# EAGLE design MySensors.org-BaseSensorWithPIR (EAGLE 7.5.0)
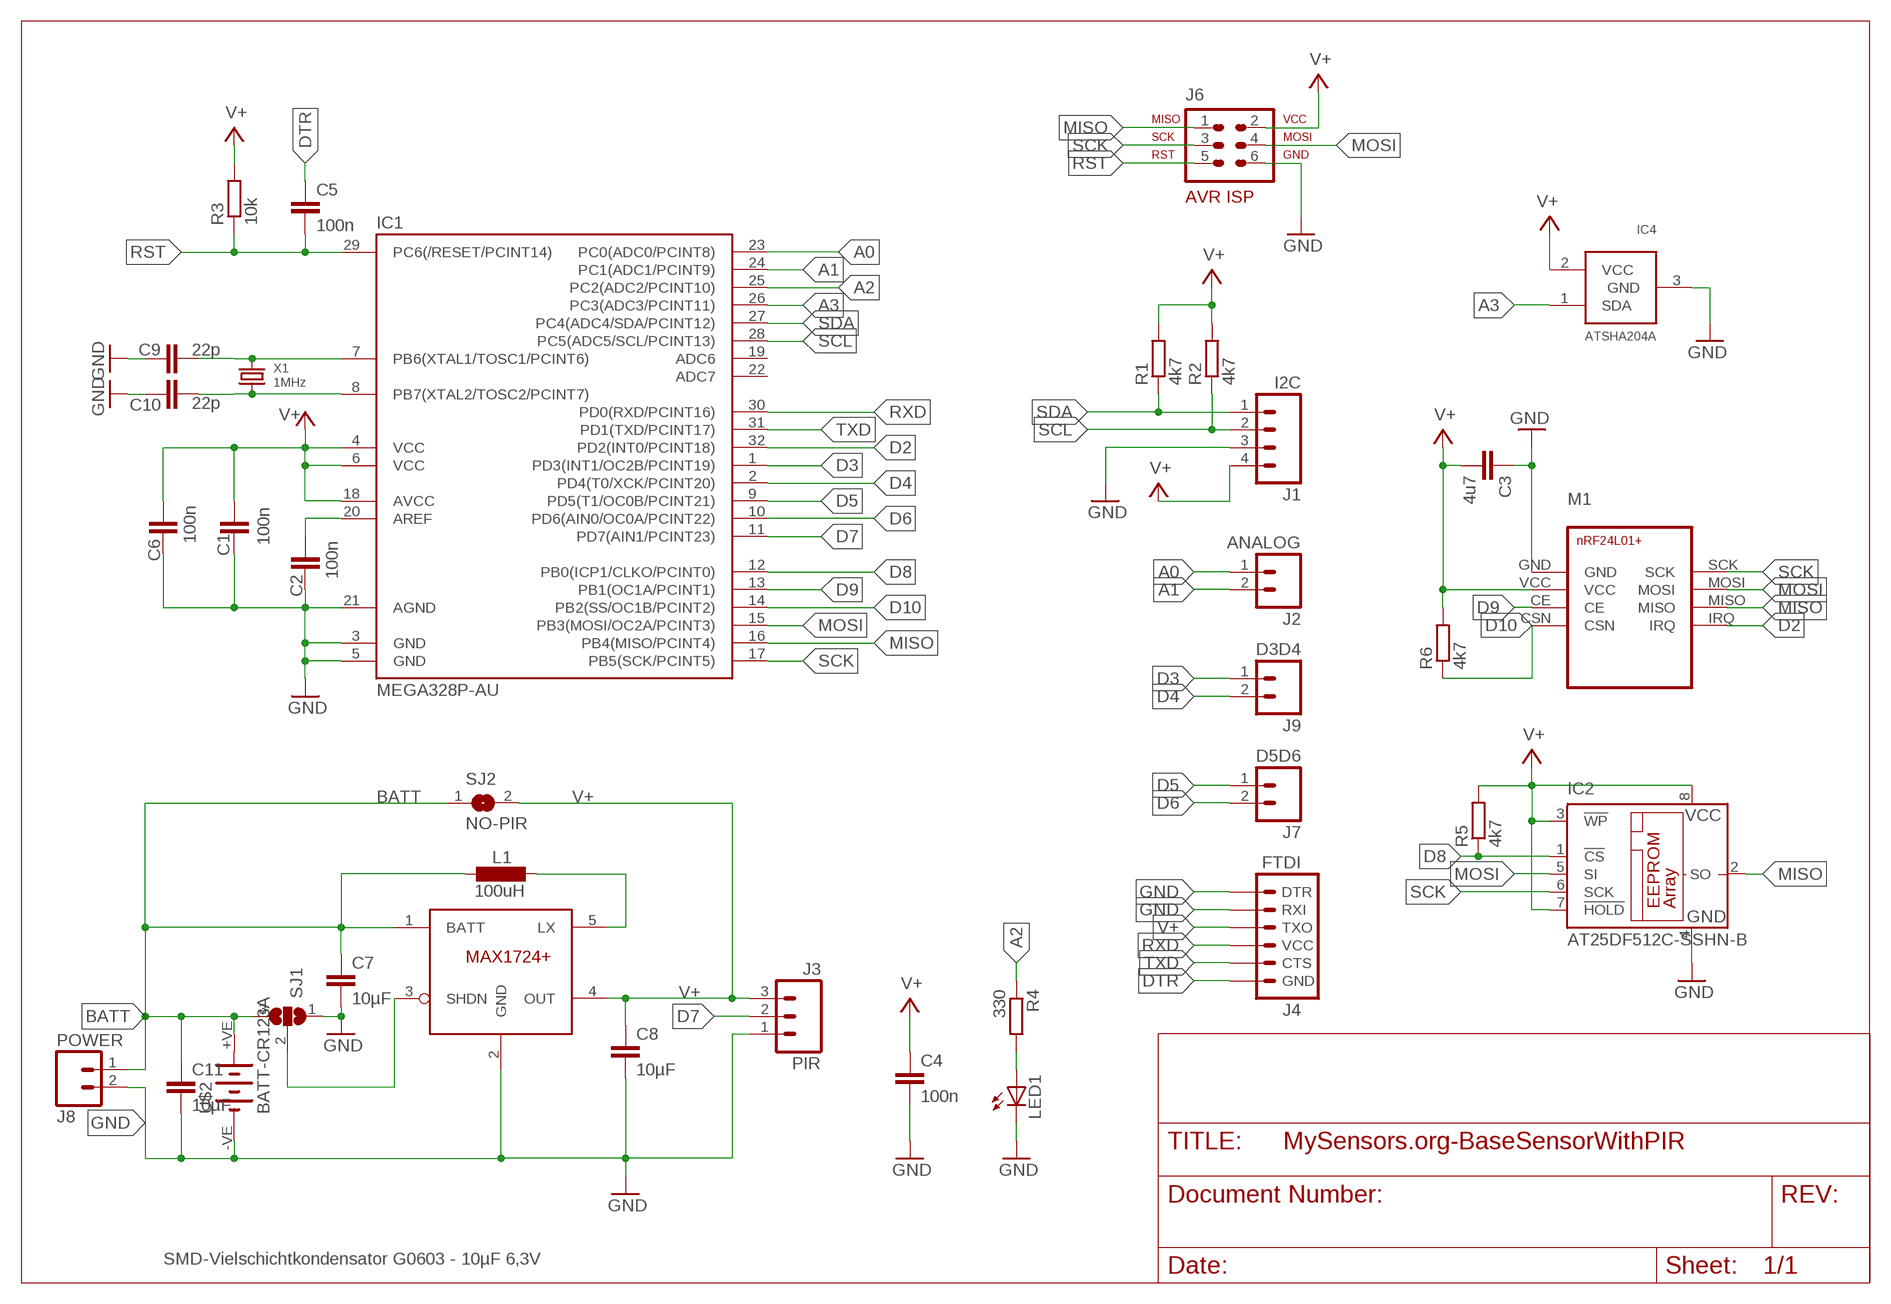
[diagram p0: schematic, sheet 1]

## Parts
C1  100n  C-EUC0603  [C0603]
C2  100n  C-EUC0603  [C0603]
C3  4u7  C-EUC0603  [C0603]
C4  100n  C-EUC0603  [C0603]
C5  100n  C-EUC0603  [C0603]
C6  100n  C-EUC0603  [C0603]
C7  10µF  C-EUC0603  [C0603]
C8  10µF  C-EUC0603  [C0603]
C9  22p  C-EUC0603  [C0603]
C10  22p  C-EUC0603  [C0603]
C11  10µF  C-EUC0603  [C0603]
IC1  MEGA328P-AU  MEGA48/88/168-AU  [TQFP32-08]
IC2  AT25DF512C-SSHN-B  25AA080SN  [SO-08]
IC4  ATSHA204A  [SOT23]
J1  I2C  M04LOCK  [1X04_LOCK]
J2  ANALOG  M02PTH  [1X02]
J3  PIR  M03LOCK  [1X03_LOCK]
J4  FTDI  ARDUINO_SERIAL_PROGRAMLOCK  [1X06_LOCK]
J6  N/M  AVR-ISP-6VERT  [AVR-ISP-6]
J7  D5D6  M02PTH  [1X02]
J8  POWER  M02PTH  [1X02]
J9  D3D4  M02PTH  [1X02]
L1  100uH  L-EU1212FPS  [1212FPS]
LED1  LEDSML0603  [SML0603]
M1  NRF24L01+NRF24L01+MINI  [NRF24L01+MINI]
R1  4k7  R-EU_R0603  [R0603]
R2  4k7  R-EU_R0603  [R0603]
R3  10k  R-EU_R0603  [R0603]
R4  330  R-EU_R0603  [R0603]
R5  4k7  R-EU_R0603  [R0603]
R6  4k7  R-EU_R0603  [R0603]
SJ1  SJ2W  [SJ_2]
SJ2  NO-PIR  SJ  [SJ]
STEPUP  MAX1724  [SOT23-5L]
U$2  BATT-CR123A  [KEYSTONE-2/3A]
X1  1MHz  CRYSTAL-306010055  [2P-L3.2XW1.5MM]

## Nets
A0: IC1.23(PC0(ADC0/PCINT8)) J2.1
A1: IC1.24(PC1(ADC1/PCINT9)) J2.2
A2: IC1.25(PC2(ADC2/PCINT10)) R4.1
A3: IC1.26(PC3(ADC3/PCINT11)) IC4.1(SDA)
BATT: C7.1 C11.1 J8.1 L1.1 SJ1.3 SJ2.1 STEPUP.1(BATT) U$2.+VE(+)
D2: IC1.32(PD2(INT0/PCINT18)) M1.IRQ
D3: IC1.1(PD3(INT1/OC2B/PCINT19)) J9.1
D4: IC1.2(PD4(T0/XCK/PCINT20)) J9.2
D5: IC1.9(PD5(T1/OC0B/PCINT21)) J7.1
D6: IC1.10(PD6(AIN0/OC0A/PCINT22)) J7.2
D7: IC1.11(PD7(AIN1/PCINT23)) J3.2
D8: IC1.12(PB0(ICP1/CLKO/PCINT0)) IC2.1(!CS) R5.1
D9: IC1.13(PB1(OC1A/PCINT1)) M1.CE
D10: IC1.14(PB2(SS/OC1B/PCINT2)) M1.CSN R6.1
DTR: C5.1 J4.6(GND)
GND [Power]: C1.2 C2.2 C3.1 C4.2 C6.2 C7.2 C8.2 C9.2 C10.2 C11.2 IC1.3(GND) IC1.5(GND) IC1.21(AGND) IC2.4(GND) IC4.3(GND) J1.3 J3.1 J4.1(DTR) J4.2(RXI) J6.6 J8.2 LED1.C M1.GND SJ1.1 STEPUP.2(GND) U$2.-VE(-)
LX: L1.2 STEPUP.5(LX)
MISO: IC1.16(PB4(MISO/PCINT4)) IC2.2(SO) J6.1 M1.MISO
MOSI: IC1.15(PB3(MOSI/OC2A/PCINT3)) IC2.5(SI) J6.4 M1.MOSI
N$3: LED1.A R4.2
N$4: C2.1 IC1.20(AREF)
RST: C5.2 IC1.29(PC6(/RESET/PCINT14)) J6.5 R3.1
RXD: IC1.30(PD0(RXD/PCINT16)) J4.4(VCC)
SCK: IC1.17(PB5(SCK/PCINT5)) IC2.6(SCK) J6.3 M1.SCK
SCL: IC1.28(PC5(ADC5/SCL/PCINT13)) J1.2 R2.1
SDA: IC1.27(PC4(ADC4/SDA/PCINT12)) J1.1 R1.1
SHDN: SJ1.2 STEPUP.3(SHDN)
TXD: IC1.31(PD1(TXD/PCINT17)) J4.5(CTS)
V+ [Power]: C1.1 C3.2 C4.1 C6.1 C8.1 IC1.4(VCC) IC1.6(VCC) IC1.18(AVCC) IC2.3(!WP) IC2.7(!HOLD) IC2.8(VCC) IC4.2(VCC) J1.4 J3.3 J4.3(TXO) J6.2 M1.VCC R1.2 R2.2 R3.2 R5.2 R6.2 SJ2.2 STEPUP.4(OUT)
XTAL1: C9.1 IC1.7(PB6(XTAL1/TOSC1/PCINT6)) X1.2
XTAL2: C10.1 IC1.8(PB7(XTAL2/TOSC2/PCINT7)) X1.1
Unconnected: IC1.19(ADC6) IC1.22(ADC7)

## Notes on the sheet
- SMD-Vielschichtkondensator G0603 - 10µF 6,3V

## Library data of the parts
C1-C11 = rcl:C-EU: CAPACITOR, European symbol
IC1 = avr-7:MEGA48/88/168
IC2 = microchip:25*: Serial EEPROM 4K/ 8K , SPI bus; MF: MICROCHIP; MPN: 25AA080/SN; OC_FARNELL: 1816072; OC_NEWARK: 92C7351
IC4 = Sensor:ATSHA204A
J1 = SparkFun-Connectors:M04: Header 4 Standard 4-pin 0.1" header. Use with straight break away headers (SKU : PRT-00116), right angle break away headers (PRT-00553), swiss pins (PRT-00743), machine pins (PRT-00117), and female headers (PRT-00115). Molex polarized connector foot print use with SKU : PRT-08231 with associated crimp pins and housings. 1MM SMD Version SKU: PRT-10208; PROD_ID: CONN-09696
J2 J7-J9 = SparkFun-Connectors:M02: Standard 2-pin 0.1" header. Use with - straight break away headers ( PRT-00116) - right angle break away headers (PRT-00553) - swiss pins (PRT-00743) - machine pins (PRT-00117) - female headers (PRT-00115) Molex polarized connector foot print use with: PRT-08233 with associated crimp pins and housings. 2.54_SCREWTERM for use with PRT-10571. 3.5mm Screw Terminal footprints for PRT-08084 5mm Screw Terminal footprints for use with PRT-08432
J3 = SparkFun-Connectors:M03: Header 3 Standard 3-pin 0.1" header. Use with straight break away headers (SKU : PRT-00116), right angle break away headers (PRT-00553), swiss pins (PRT-00743), machine pins (PRT-00117), and female headers (PRT-00115). Molex polarized connector foot print use with SKU : PRT-08232 with associated crimp pins and housings.
J4 = SparkFun-Connectors:ARDUINO_SERIAL_PROGRAM: FTDI connector footprints
J6 = avr-7:AVR-ISP-6: AVR ISP-6 Serial Programming Header
L1 = inductor:L-EU: INDUCTOR, European symbol
LED1 = led:LED: LED OSRAM: - CHIPLED LG R971, LG N971, LY N971, LG Q971, LY Q971, LO R971, LY R971 LH N974, LH R974 LS Q976, LO Q976, LY Q976 LO Q996 - Hyper CHIPLED LW Q18S LB Q993, LB Q99A, LB R99A - SideLED LS A670, LO A670, LY A670, LG A670, LP A670 LB A673, LV A673, LT A673, LW A673 LH A674 LY A675 LS A676, LA A676, LO A676, LY A676, LW A676 LS A679, LY A679, LG A679 - Hyper Micro SIDELED® LS Y876, LA Y876, LO Y876, LY Y876 LT Y87S - SmartLED LW L88C, LW L88S LB L89C, LB L89S, LG L890 LS L89K, LO L89K, LY L89K LS L896, LA L896, LO L896, LY L896 - TOPLED LS T670, LO T670, LY T670, LG T670, LP T670 LSG T670, LSP T670, LSY T670, LOP T670, LYG T670 LG T671, LOG T671, LSG T671 LB T673, LV T673, LT T673, LW T673 LH T674 LS T676, LA T676, LO T676, LY T676, LB T676, LH T676, LSB T676, LW T676 LB T67C, LV T67C, LT T67C, LS T67K, LO T67K, LY T67K, LW E67C LS E67B, LA E67B, LO E67B, LY E67B, LB E67C, LV E67C, LT E67C LW T67C LS T679, LY T679, LG T679 LS T770, LO T770, LY T770, LG T770, LP T770 LB T773, LV T773, LT T773, LW T773 LH T774 LS E675, LA E675, LY E675, LS T675 LS T776, LA T776, LO T776, LY T776, LB T776 LHGB T686 LT T68C, LB T68C - Hyper Mini TOPLED® LB M676 - Mini TOPLED Santana® LG M470 LS M47K, LO M47K, LY M47K Source: http://www.osram.convergy.de LUXEON: - LUMILED® LXK2-PW12-R00, LXK2-PW12-S00, LXK2-PW14-U00, LXK2-PW14-V00 LXK2-PM12-R00, LXK2-PM12-S00, LXK2-PM14-U00 LXK2-PE12-Q00, LXK2-PE12-R00, LXK2-PE12-S00, LXK2-PE14-T00, LXK2-PE14-U00 LXK2-PB12-K00, LXK2-PB12-L00, LXK2-PB12-M00, LXK2-PB14-N00, LXK2-PB14-P00, LXK2-PB14-Q00 LXK2-PR12-L00, LXK2-PR12-M00, LXK2-PR14-Q00, LXK2-PR14-R00 LXK2-PD12-Q00, LXK2-PD12-R00, LXK2-PD12-S00 LXK2-PH12-R00, LXK2-PH12-S00 LXK2-PL12-P00, LXK2-PL12-Q00, LXK2-PL12-R00 Source: www.luxeon.com KINGBRIGHT: KA-3528ASYC Source: www.kingbright.com
M1 = my_modules:NRF24L01+: nRF24L01+ Transceiver Module
R1-R6 = rcl:R-EU_: RESISTOR, European symbol
SJ1 = jumper:SJ2W: SMD solder JUMPER
SJ2 = jumper:SJ: SMD solder JUMPER
STEPUP = MAX1724:MAX1724
U$2 = Gulpman:BATT-CR123A: CR123A (2/3rd AA) battery holder Manufacturer: Keystone Mouser part: 534-1019
X1 = cristal:CRYSTAL*

## Net classes
0 default: width 0.203 mm
1 Power: width 0.406 mm

## Board
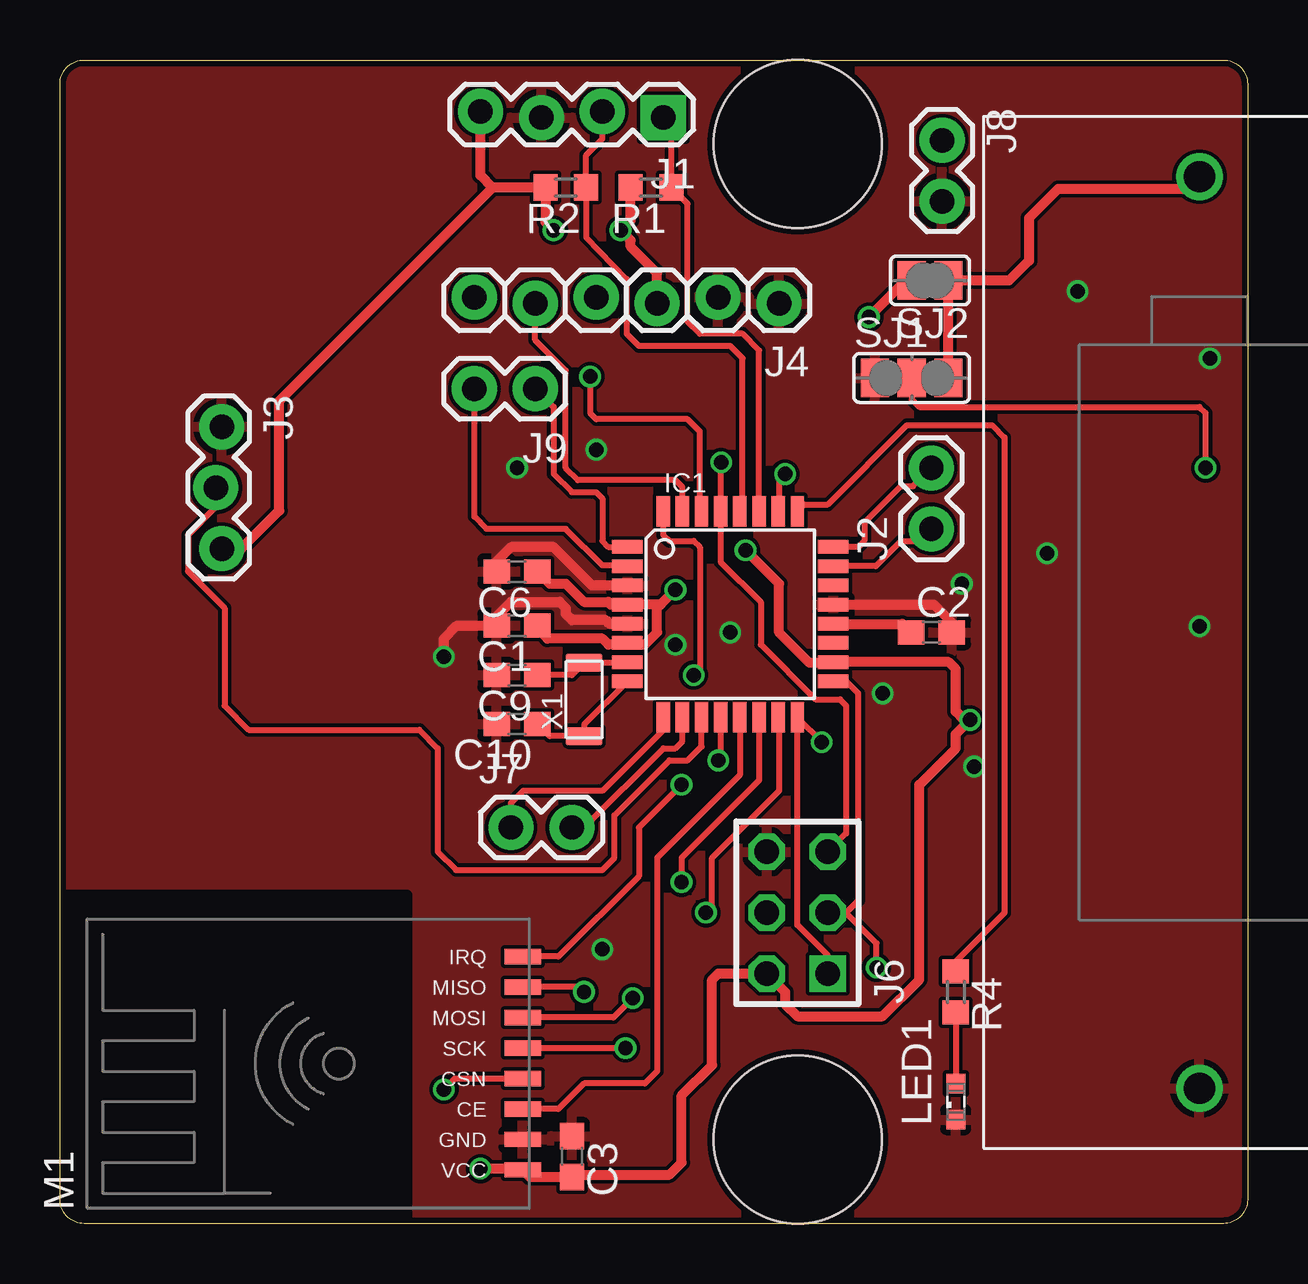
[diagram p1: board, top side]
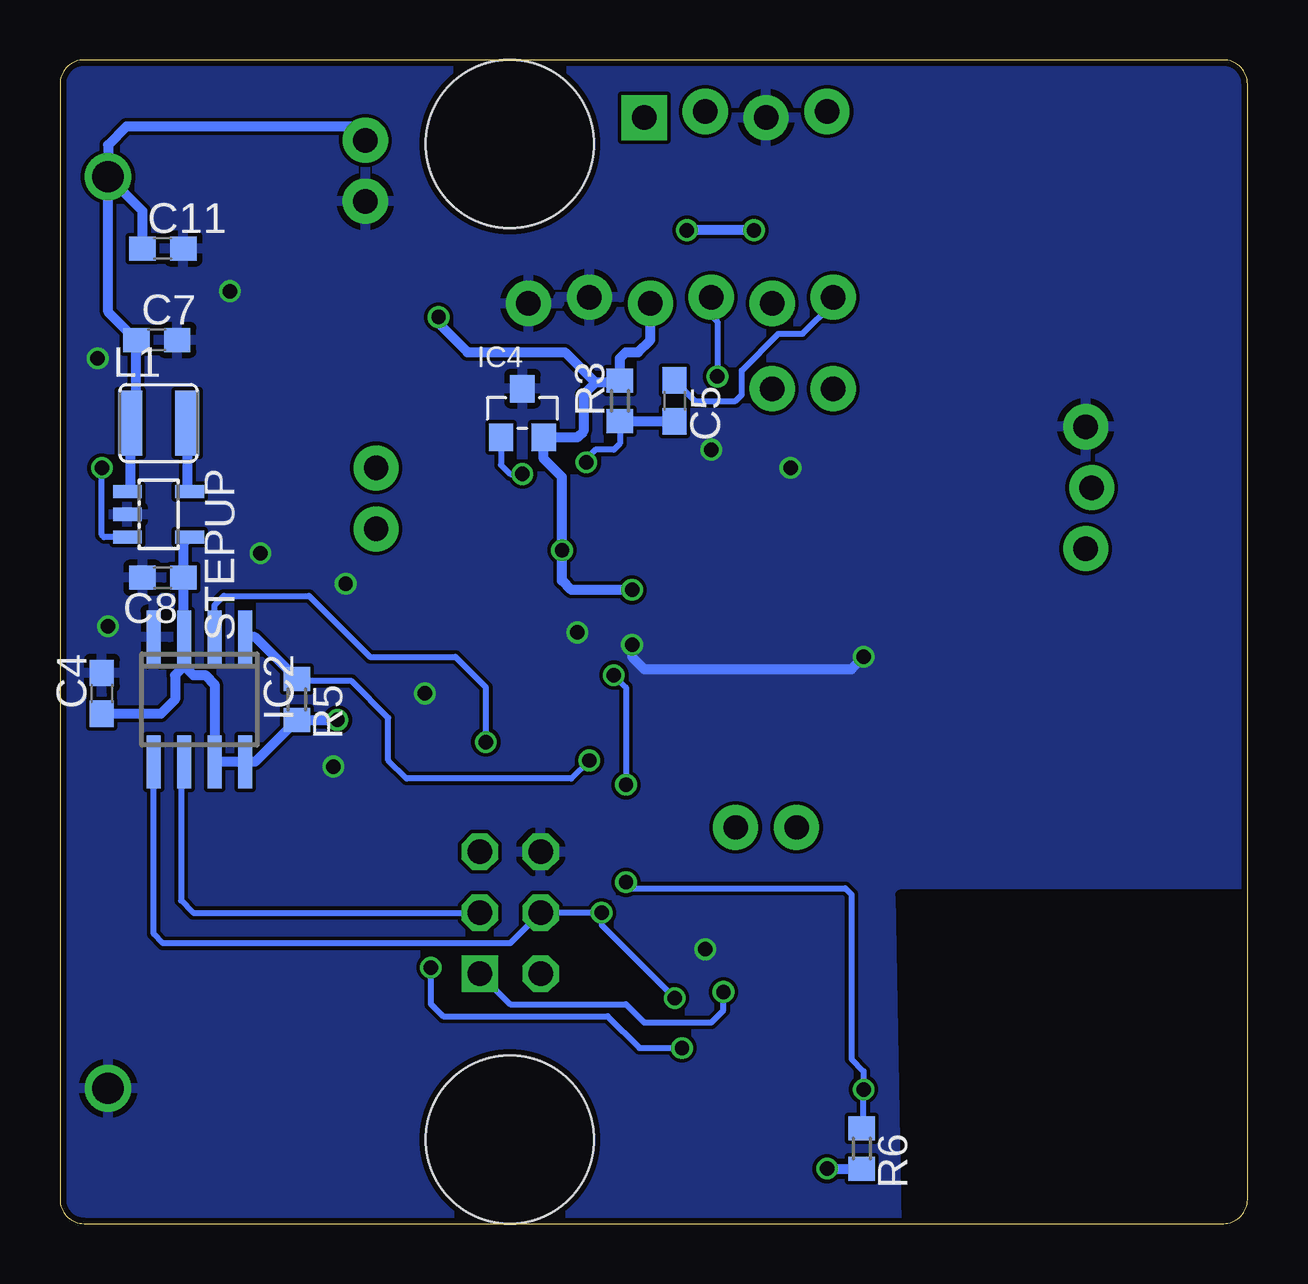
[diagram p2: board, bottom side, seen from below]

Size 49.5 x 48.5 mm. Coordinates in mm from the lower left corner, seen from the top.
Outline: 0,1 0,47.5 arc-90 1,48.5 48.5,48.5 arc-90 49.5,47.5 49.5,1 arc-90 48.5,0 1,0 arc-90 0,1
Copper layers (1*16): Top 0.035mm / dielectric 1.5mm / Bottom 0.035mm
Design rules "SeeedStudio_2layer_DRU_no_angle_20140221": minimum track width 6mil, minimum drill 12mil, track to track 6mil, track to pad 6mil, pad to pad 6mil, via to via 6mil, smd to smd 0mil, copper to edge 10mil, drill to drill 10mil, minimum pad ring 10mil, minimum via ring 6mil, stop-mask expansion 2mil, vias tented up to drill 100mil, thermal gap 10mil
Holes 7 mm at 30.75,3.5 30.75,45
tKeepout: area 0,15 to 15,47
tRestrict: area 0,0 to 14.5,13.7
bRestrict: area 0,0 to 14.5,13.7

### Footprints (pad centres in the part's own frame; a part is rotated, then mirrored left to right if it is on the bottom)
C0603 = smd 1.1 x 1: 1 -0.85,0; 2 0.85,0
TQFP32-08 = smd 1.27 x 0.559: 1 -4.293,2.8; 2 -4.293,2; 3 -4.293,1.2; 4 -4.293,0.4; 5 -4.293,-0.4; 6 -4.293,-1.2; 7 -4.293,-2; 8 -4.293,-2.8; 17 4.293,-2.8; 18 4.293,-2; 19 4.293,-1.2; 20 4.293,-0.4; 21 4.293,0.4; 22 4.293,1.2; 23 4.293,2; 24 4.293,2.8 | smd 0.559 x 1.27: 9 -2.8,-4.293; 10 -2,-4.293; 11 -1.2,-4.293; 12 -0.4,-4.293; 13 0.4,-4.293; 14 1.2,-4.293; 15 2,-4.293; 16 2.8,-4.293; 25 2.8,4.293; 26 2,4.293; 27 1.2,4.293; 28 0.4,4.293; 29 -0.4,4.293; 30 -1.2,4.293; 31 -2,4.293; 32 -2.8,4.293
SO-08 = smd 0.6 x 2.2: 1 -1.905,-2.6; 2 -0.635,-2.6; 3 0.635,-2.6; 4 1.905,-2.6; 5 1.905,2.6; 6 0.635,2.6; 7 -0.635,2.6; 8 -1.905,2.6
SOT23 = smd 1.016 x 1.143: 1 -0.889,-1.016; 2 0.889,-1.016; 3 0,1.016
1X04_LOCK = drill 1.016 pad 1.88 square: 1 0,0.127 | drill 1.016 pad 1.88: 2 2.54,-0.127; 3 5.08,0.127; 4 7.62,-0.127
1X02 = drill 1.016 pad 1.88: 1 0,0; 2 2.54,0
1X03_LOCK = drill 1.016 pad 1.88: 1 0,0.127; 2 2.54,-0.127; 3 5.08,0.127
1X06_LOCK = drill 1.016 pad 1.88: 1 0,0; 2 2.54,-0.254; 3 5.08,0; 4 7.62,-0.254; 5 10.16,0; 6 12.7,-0.254
AVR-ISP-6 = drill 1.016 square: 1 -2.54,-1.27 | drill 1.016 octagon: 2 -2.54,1.27; 3 0,-1.27; 4 0,1.27; 5 2.54,-1.27; 6 2.54,1.27
1212FPS = smd 1 x 2.7: 1 -1.188,0; 2 1.188,0
SML0603 = smd 0.8 x 0.8: A 0.75,0; C -0.75,0
NRF24L01+MINI = smd 0.635 x 1.524: CE -1.575,-7.861; CSN -0.305,-7.861; GND -2.845,-7.861; IRQ 4.775,-7.861; MISO 3.505,-7.861; MOSI 2.235,-7.861; SCK 0.965,-7.861; VCC -4.115,-7.861
R0603 = smd 1 x 1.1: 1 -0.85,0; 2 0.85,0
SJ_2 = smd 1.168 x 1.6: 1 -1.524,0; 2 0,0; 3 1.524,0
SJ = smd 1.168 x 1.6: 1 -0.762,0; 2 0.762,0
SOT23-5L = smd 0.55 x 1.2: 1 -0.95,-1.3; 2 0,-1.3; 3 0.95,-1.3; 4 0.95,1.3; 5 -0.95,1.3
KEYSTONE-2/3A = drill 1.3: +VE 0,19; -VE 0,-19
2P-L3.2XW1.5MM = smd 0.762 x 1.524: 1 -1.524,0; 2 1.524,0

### Placement (x,y rotation side)
C1  19.05,24.92 180 top
C2  36.32,24.64 0 top
C3  21.34,2.79 270 top
C4  47.75,22.1 90 bottom
C5  23.88,34.29 270 bottom
C6  19.05,27.18 180 top
C7  45.47,36.83 0 bottom
C8  45.21,26.92 180 bottom
C9  19.05,22.86 180 top
C10  19.05,20.83 180 top
C11  45.21,40.64 0 bottom
IC1  27.94,25.4 0 top
IC2  43.69,21.84 180 bottom
IC4  30.23,33.78 0 bottom
J1  25.15,46.23 180 top
J2  36.32,28.96 90 top
J3  6.62,33.21 270 top
J4  29.97,38.35 180 top
J6  30.73,12.95 90 top
J7  18.8,16.51 0 top
J8  36.77,45.15 270 top
J9  19.81,34.8 180 top
L1  45.39,33.37 0 bottom
LED1  37.34,5.08 90 top
M1  11.43,6.35 90 top
R1  24.64,43.18 180 top
R2  21.08,43.18 180 top
R3  26.16,34.29 90 bottom
R4  37.34,9.65 270 top
R5  39.62,21.84 270 bottom
R6  16.08,3.12 270 bottom
SJ1  35.5,35.24 0 top
SJ2  36.26,39.31 180 top
STEPUP  45.39,29.56 270 bottom
U$2  47.5,24.64 0 top
X1  21.84,21.84 90 top

### Tracks (layer width: path | path; a pad name or v marks a point on that pad's centre or on a via)
A0
  Top 0.254: IC1.23 34,27.4 35.05,28.45 35.81,28.45 J2.1
A1
  Top 0.254: IC1.24 33.28,28.2 33.53,28.45 33.53,29.21 35.05,30.73 35.56,30.73 J2.2
A2
  Top 0.254: IC1.25 31.02,29.97 32,29.97 35.31,33.27 38.86,33.27 39.37,32.77 39.37,12.95 37.34,10.92 R4.1
A3  (via drill 0.6)
  Top 0.254: IC1.26 29.97,29.73 29.97,30.99 v30.23,31.24
  Bottom 0.254: IC4.1 31.11,31.62 30.73,31.24 v30.23,31.24
BATT
  Top 0.406: SJ1.3 SJ2.1 39.56,39.31 40.39,40.13 40.39,41.91 41.61,43.13 46.99,43.13 U$2.+VE
  Bottom 0.406: STEPUP.1 46.58,30.62 L1.1 46.32,33.63 C7.1 47.48,38 47.48,43.62 U$2.+VE | C11.1 46.06,42.2 U$2.+VE | J8.1 37.34,45.72 46.74,45.72 47.5,44.96 U$2.+VE
D2  (via drill 0.6)
  Top 0.254: M1.IRQ 20.78,11.12 24.13,14.48 24.13,16.51 v25.91,18.29 | IC1.32 25.14,28.71 25.4,28.45 26.42,28.45 26.67,28.19 26.67,23.11 v26.42,22.86
  Bottom 0.254: v25.91,18.29 25.91,22.35 v26.42,22.86
D3
  Top 0.254: J9.1 20.57,34.04 20.57,31.24 21.34,30.48 22.35,30.48 22.61,30.23 22.61,28.45 22.85,28.2 IC1.1
D4
  Top 0.254: IC1.2 23.61,27.43 22.61,27.43 21.08,28.96 17.78,28.96 17.27,29.46 J9.2
D5
  Top 0.254: IC1.9 25.17,20.6 22.61,18.03 19.3,18.03 18.8,17.53 J7.1
D6
  Top 0.254: J7.2 21.84,16.51 25.15,19.81 25.65,19.81 25.94,20.1 IC1.10
D7
  Top 0.254: J3.2 6.49,29.86 5.33,28.7 5.33,27.18 6.86,25.65 6.86,21.59 7.87,20.57 14.99,20.57 15.75,19.81 15.75,15.49 16.51,14.73 22.61,14.73 23.11,15.24 23.11,17.02 25.4,19.3 26.16,19.3 26.74,19.88 IC1.11
D8  (via drill 0.6)
  Top 0.254: IC1.12 27.54,19.41 v27.43,19.3
  Bottom 0.254: v27.43,19.3 28.19,18.54 35.05,18.54 35.81,19.3 35.81,21.08 37.34,22.61 39.54,22.61 R5.1
  Bottom 0.406: R5.1 41.37,24.44 IC2.1
D9
  Top 0.254: IC1.13 28.34,18.69 24.89,15.24 24.89,6.35 24.38,5.84 21.84,5.84 20.78,4.78 M1.CE
D10  (via drill 0.6)
  Top 0.254: v16,5.59 16.46,6.04 M1.CSN | IC1.14 29.14,18.47 25.91,15.24 v25.91,14.22
  Bottom 0.254: R6.1 16,4.05 v16,5.59 16,6.35 16.51,6.86 16.51,13.72 16.76,13.97 25.65,13.97 v25.91,14.22
DTR
  Bottom 0.254: C5.1 23.03,34.29 21.34,34.29 21.08,34.54 21.08,35.56 19.56,37.08 18.54,37.08 17.27,38.35 J4.6
GND  (via drill 0.6)
  Top 0.406: IC1.21 36.43,25.8 37.17,25.06 C2.2 | IC1.5 23.01,25 23,24.99 22.91,24.99 22.76,25.15 21.34,25.15 21.08,25.4 21.08,25.65 20.83,25.91 18.8,25.91 18.2,25.31 C1.2 16.54,24.92 16,24.38 v16,23.62 | IC1.3 22.96,26.59 22.17,26.59 20.57,28.19 18.8,28.19 18.2,27.6 C6.2
  Bottom 0.406: v25.65,24.13 25.65,23.62 25.15,23.11 16.51,23.11 v16,23.62
  other vias: 37.59,26.67 41.15,27.94 47.5,24.89 27.94,24.64 42.42,38.86 19.05,31.5 22.35,32.26 38.1,19.05 34.29,22.1 22.61,11.43 47.93,36.07
  pour Top: 0,48.51 50.04,48.51 50.04,0 0,0
  pour Bottom: 0,0 50.04,0 50.04,48.51 0,48.51
LX
  Bottom 0.406: L1.2 44.2,30.62 STEPUP.5
MISO  (via drill 0.6)
  Top 0.254: J6.1 32,11.18 30.73,12.45 IC1.16 30.77,21.08 30.77,21.05 v31.75,20.07 | v21.84,9.65 21.64,9.86 M1.MISO
  Bottom 0.254: IC2.2 43.05,25.78 42.67,26.16 39.12,26.16 36.58,23.62 33.02,23.62 31.75,22.35 v31.75,20.07 | J6.1 30.73,9.14 25.91,9.14 25.15,8.38 22.35,8.38 21.84,8.89 v21.84,9.65
MOSI  (via drill 0.6)
  Top 0.254: IC1.15 29.97,21.07 29.97,18.03 27.18,15.24 27.18,13.21 v26.92,12.95 | v23.88,9.4 23.06,8.59 M1.MOSI
  Bottom 0.254: IC2.5 45.59,12.06 45.21,11.68 30.73,11.68 J6.4 v26.92,12.95 26.92,12.45 v23.88,9.4
N$3
  Top 0.254: R4.2 LED1.A
N$4
  Top 0.406: IC1.20 35.11,25 C2.1
RST  (via drill 0.6)
  Top 0.254: v27.56,31.73 27.56,29.71 IC1.29 27.54,27.58 29.21,25.91 29.21,24.13 31.5,21.84 32.51,21.84 32.77,21.59 32.77,16.26 J6.5
  Bottom 0.254: R3.1 26.16,32.51 26.42,32.26 27.18,32.26 27.56,31.88 v27.56,31.73
  Bottom 0.406: R3.1 C5.2
RXD  (via drill 0.6)
  Top 0.254: v22.1,35.31 22.1,33.78 22.35,33.53 26.16,33.53 26.67,33.02 26.67,29.76 IC1.30
  Bottom 0.254: J4.4 22.35,37.85 22.1,37.59 v22.1,35.31
SCK  (via drill 0.6)
  Top 0.254: M1.SCK v23.57,7.32 | J6.3 32.77,12.95 | 32.77,12.95 33.27,13.46 33.27,22.1 32.77,22.6 IC1.17 | v34.04,10.67 34.04,11.68 32.77,12.95
  Bottom 0.254: IC2.6 44.45,19.12 44.45,13.46 43.94,12.95 J6.3 | v34.04,10.67 34.04,9.14 33.53,8.64 26.67,8.64 25.35,7.32 v23.57,7.32
SCL
  Top 0.254: J1.2 22.61,45.21 21.93,44.54 R2.1 21.93,41.11 23.62,39.37 23.62,37.08 24.13,36.58 27.94,36.58 28.45,36.07 28.45,29.8 IC1.28
SDA
  Top 0.254: J1.1 25.49,45.76 R1.1 26.16,42.51 26.16,37.59 26.67,37.08 28.45,37.08 29.14,36.39 IC1.27
SHDN  (via drill 0.6)
  Top 0.254: SJ1.2 35.5,34.35 35.81,34.04 47.5,34.04 47.75,33.78 v47.75,31.5
  Bottom 0.254: STEPUP.3 47.66,28.61 47.75,28.7 v47.75,31.5
TXD
  Top 0.254: IC1.31 25.94,30.7 25.65,30.99 21.59,30.99 21.08,31.5 21.08,35.56 19.81,36.83 J4.5
V+  (via drill 0.6)
  Top 0.406: IC1.6 23.58,24.13 | 23.58,24.13 22.86,24.13 22.61,24.38 20.32,24.38 19.9,24.8 C1.1 | C6.1 20.41,26.67 21.08,26.67 21.84,25.91 22.86,25.91 22.97,25.8 IC1.4 24.89,25.8 | v17.53,2.29 19.24,2.29 M1.VCC 19.58,1.94 C3.2 21.42,2.03 25.4,2.03 25.91,2.54 25.91,5.33 27.18,6.6 27.18,10.16 27.43,10.41 J6.2 30.23,9.65 30.23,9.14 30.73,8.64 34.29,8.64 35.81,10.16 35.81,18.29 37.34,19.81 37.34,20.4 v37.93,20.99 37.68,20.99 37.34,21.34 37.34,23.11 37.05,23.4 IC1.18 32.2,23.37 31.24,23.37 29.97,24.64 29.97,26.67 v28.57,28.07 | 18.03,43.18 R2.2 20.23,41.74 v20.57,41.4 | 18.03,43.18 17.53,43.69 J1.4 | J4.3 24.89,39.62 23.79,40.73 23.79,40.98 v23.37,41.4 23.79,41.82 R1.2 | v25.65,26.42 25.04,25.8 24.89,25.8 | 23.58,24.13 24.38,24.13 24.89,24.64 24.89,25.8 | J3.3 7.56,28.13 9.14,29.72 9.14,34.29 18.03,43.18 | SJ2.2 35.24,39.31 v33.72,37.78
  Bottom 0.406: v17.53,2.29 17.51,2.27 R6.2 | STEPUP.4 44.36,28.34 C8.1 44.36,24.48 IC2.3 44.32,23.24 | 44.32,23.24 43.94,22.86 43.43,22.86 43.05,22.48 IC2.7 IC2.8 41.37,19.24 R5.2 v37.93,20.99 | R3.2 26.16,36.07 25.91,36.32 25.4,36.32 24.89,36.83 J4.3 | R3.2 26.25,35.05 27.18,35.05 | 27.18,35.05 27.69,34.54 27.69,33.02 27.94,32.77 IC4.2 29.34,31.88 28.57,31.11 v28.57,28.07 28.57,26.8 28.19,26.42 v25.65,26.42 | R3.2 26.07,35.05 | v33.72,37.78 33.72,37.53 32.51,36.32 28.45,36.32 27.18,35.05 | v20.57,41.4 v23.37,41.4 | 44.32,23.24 44.7,22.86 44.7,21.84 45.3,21.25 C4.1
XTAL1
  Top 0.254: IC1.7 23.61,23.37 X1.2 21.34,22.86 C9.1
XTAL2
  Top 0.254: IC1.8 21.84,20.8 X1.1 20.41,20.32 C10.1

### Text on the board
Document: ABS-82